# EAGLE schematic NanoRemotev2 (EAGLE 6.1)
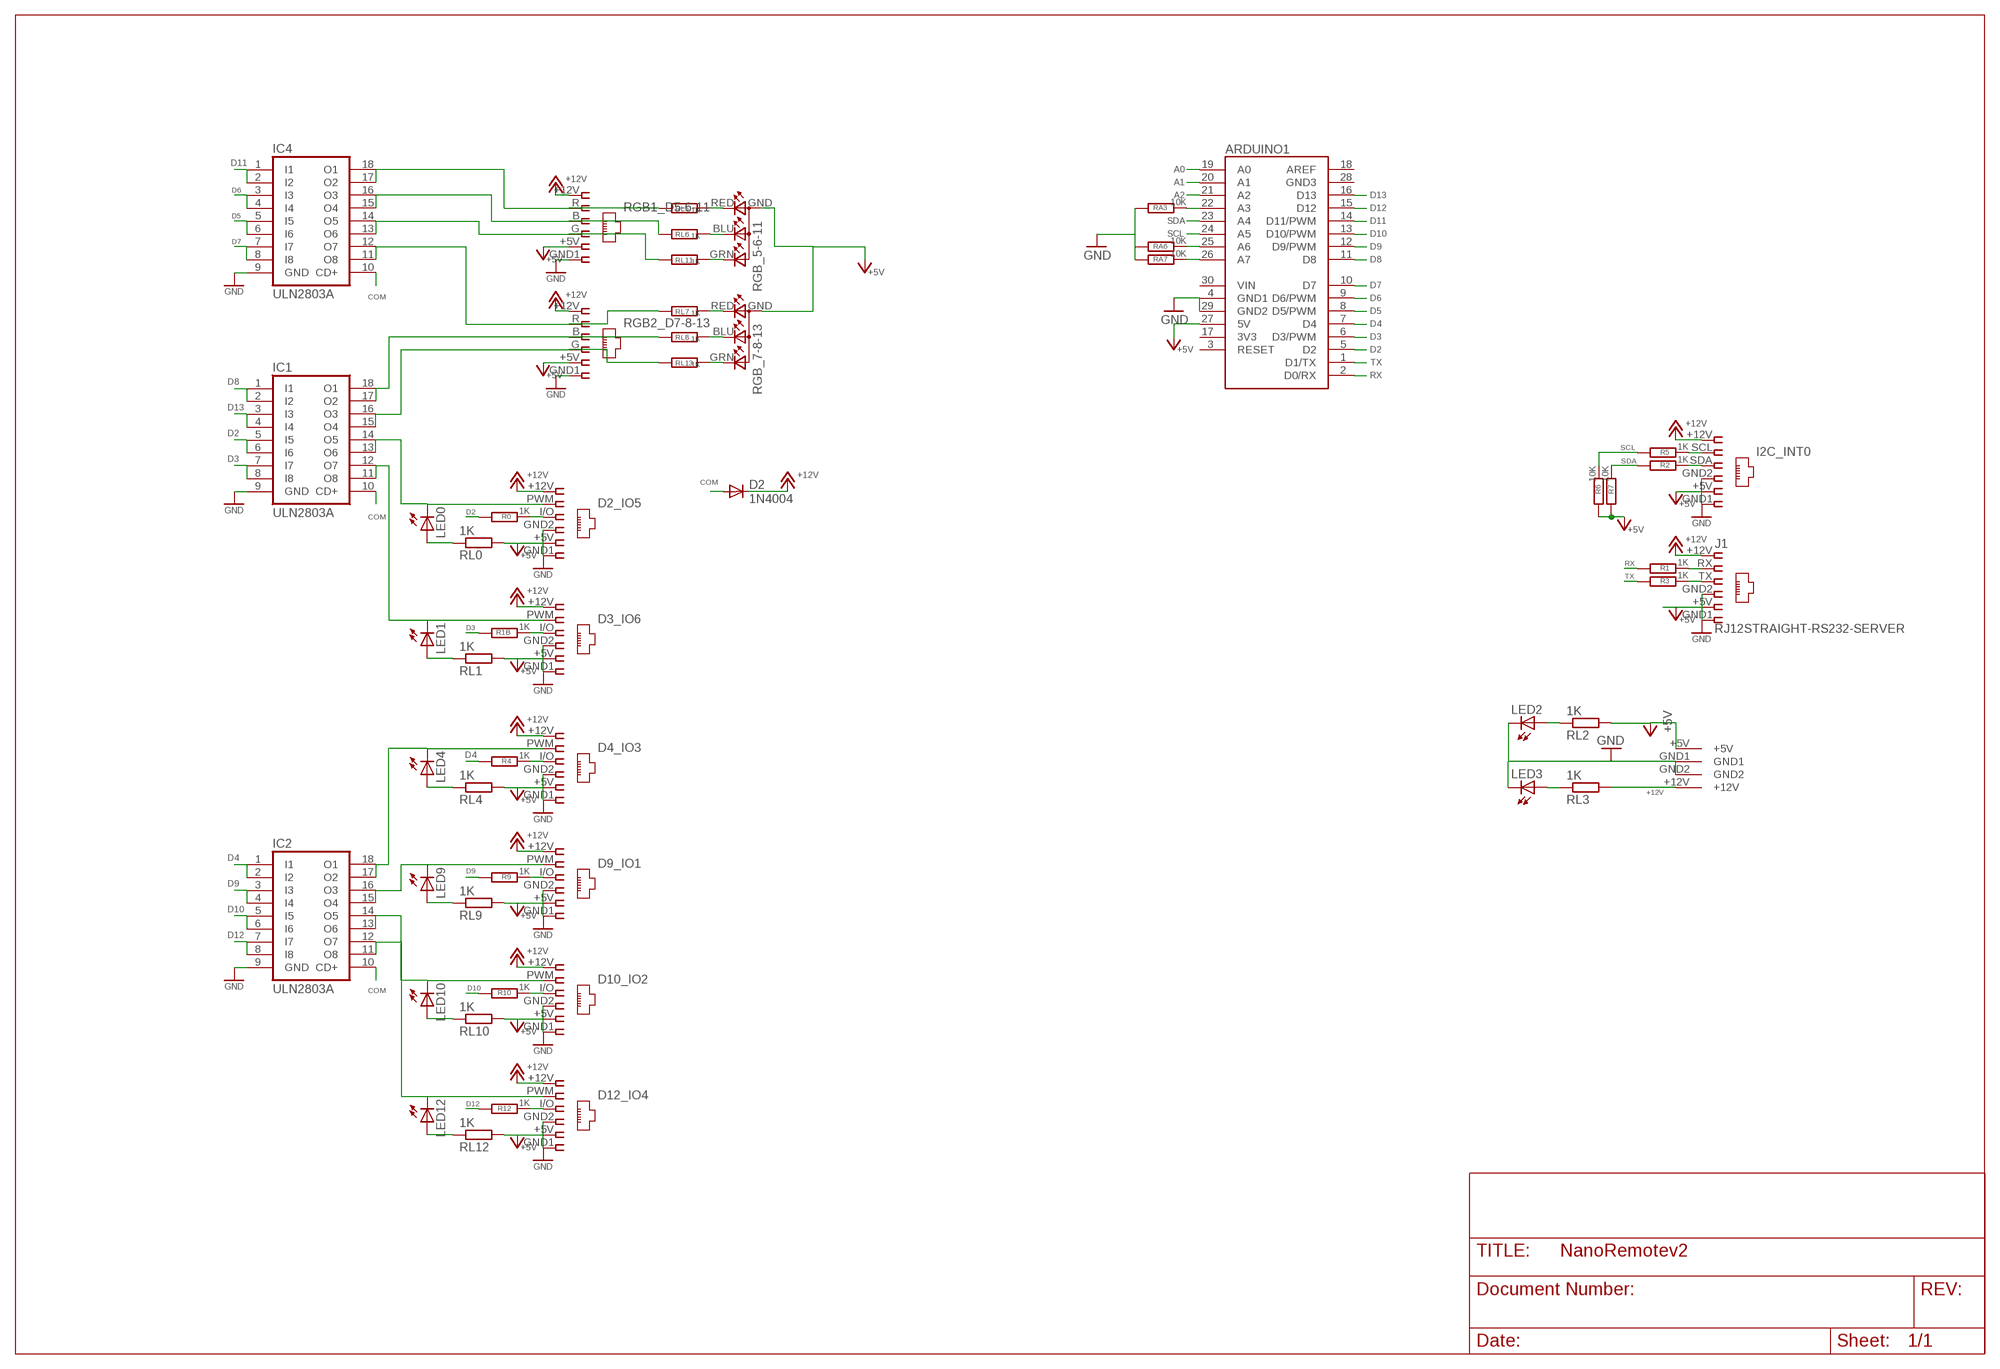
[diagram p0: schematic, sheet 1]

## Parts
ARDUINO1  ARDUINO_NANO  [ARDUINO_NANO]
D2  1N4004  [DO41-10]
D2_IO5  IO5  RJ12STRAIGHT  [RJ12-STRAIGHT]
D3_IO6  IO6  RJ12STRAIGHT  [RJ12-STRAIGHT]
D4_IO3  IO3  RJ12STRAIGHT  [RJ12-STRAIGHT]
D9_IO1  IO1  RJ12STRAIGHT  [RJ12-STRAIGHT]
D10_IO2  IO2  RJ12STRAIGHT  [RJ12-STRAIGHT]
D12_IO4  IO4  RJ12STRAIGHT  [RJ12-STRAIGHT]
I2C_INT0  I2C  RJ12STRAIGHT-I2C  [RJ12-STRAIGHT-I2C]
IC1  ULN2803A  [SO18W]
IC2  ULN2803A  [SO18W]
IC4  ULN2803A  [SO18W]
J1  RJ12STRAIGHT-RS232-SERVER  [RJ12-STRAIGHT-RS232]
LED0  LED3MM  [LED3MM]
LED1  LED3MM  [LED3MM]
LED2  LED3MM  [LED3MM]
LED3  LED3MM  [LED3MM]
LED4  LED3MM  [LED3MM]
LED9  LED3MM  [LED3MM]
LED10  LED3MM  [LED3MM]
LED12  LED3MM  [LED3MM]
R0  1K  R-EU_M1206  [M1206]
R1  1K  R-EU_M1206  [M1206]
R1B  1K  R-EU_M1206  [M1206]
R2  1K  R-EU_M1206  [M1206]
R3  1K  R-EU_M1206  [M1206]
R4  1K  R-EU_M1206  [M1206]
R5  1K  R-EU_M1206  [M1206]
R6  10K  R-EU_M1206  [M1206]
R7  10K  R-EU_M1206  [M1206]
R9  1K  R-EU_M1206  [M1206]
R10  1K  R-EU_M1206  [M1206]
R12  1K  R-EU_M1206  [M1206]
RA3  10K  R-EU_M1206  [M1206]
RA6  10K  R-EU_M1206  [M1206]
RA7  10K  R-EU_M1206  [M1206]
RGB1_D5-6-11  RGB1  RJ12STRAIGHT-RGB  [RJ12-STRAIGHT-RGB]
RGB2_D7-8-13  RGB2  RJ12STRAIGHT-RGB  [RJ12-STRAIGHT-RGB]
RGB_5-6-11  TOPLED-3  [LED-TRICOLOR-THROUGHHOLE]
RGB_7-8-13  TOPLED-3  [LED-TRICOLOR-THROUGHHOLE]
RL0  1K  R-EU_M1206  [M1206]
RL1  1K  R-EU_M1206  [M1206]
RL2  1K  R-EU_M1206  [M1206]
RL3  1K  R-EU_M1206  [M1206]
RL4  1K  R-EU_M1206  [M1206]
RL5  1K  R-EU_M1206  [M1206]
RL6  1K  R-EU_M1206  [M1206]
RL7  1K  R-EU_M1206  [M1206]
RL8  1K  R-EU_M1206  [M1206]
RL9  1K  R-EU_M1206  [M1206]
RL10  1K  R-EU_M1206  [M1206]
RL11  1K  R-EU_M1206  [M1206]
RL12  1K  R-EU_M1206  [M1206]
RL13  1K  R-EU_M1206  [M1206]
U$1  KPJX-4S-S  [KPJX-4S-S]

## Nets
+5V [highpower]: ARDUINO1.27(5V) D2_IO5.+5V D3_IO6.+5V D4_IO3.+5V D9_IO1.+5V D10_IO2.+5V D12_IO4.+5V I2C_INT0.+5V J1.+5V R6.2 R7.2 RGB1_D5-6-11.+5V RGB2_D7-8-13.+5V RGB_5-6-11.GND(A2) RGB_7-8-13.GND(A2) RL0.2 RL1.2 RL2.2 RL4.2 RL9.2 RL10.2 RL12.2 U$1.+5V
+12V [highpower]: D2.C D2_IO5.+12V D3_IO6.+12V D4_IO3.+12V D9_IO1.+12V D10_IO2.+12V D12_IO4.+12V I2C_INT0.+12V J1.+12V RGB1_D5-6-11.+12V RGB2_D7-8-13.+12V RL3.2 U$1.+12V
A0: ARDUINO1.19(A0)
A1: ARDUINO1.20(A1)
A2: ARDUINO1.21(A2)
COM: D2.A IC1.10(CD+) IC2.10(CD+) IC4.10(CD+)
D2: ARDUINO1.5(D2) IC1.5(I5) IC1.6(I6) R0.2
D2B: D4_IO3.I/O R4.1
D2B1: D9_IO1.I/O R9.1
D2B2: D10_IO2.I/O R10.1
D2B3: D12_IO4.I/O R12.1
D2B4: I2C_INT0.SDA R2.1
D2B5: J1.TX R3.1
D2B6: D2_IO5.I/O R0.1
D2B7: D3_IO6.I/O R1B.1
D3: ARDUINO1.6(D3/PWM) IC1.7(I7) IC1.8(I8) R1B.2
D4: ARDUINO1.7(D4) IC2.1(I1) IC2.2(I2) R4.2
D5: ARDUINO1.8(D5/PWM) IC4.5(I5) IC4.6(I6)
D6: ARDUINO1.9(D6/PWM) IC4.3(I3) IC4.4(I4)
D7: ARDUINO1.10(D7) IC4.7(I7) IC4.8(I8)
D8: ARDUINO1.11(D8) IC1.1(I1) IC1.2(I2)
D9: ARDUINO1.12(D9/PWM) IC2.3(I3) IC2.4(I4) R9.2
D10: ARDUINO1.13(D10/PWM) IC2.5(I5) IC2.6(I6) R10.2
D11: ARDUINO1.14(D11/PWM) IC4.1(I1) IC4.2(I2)
D12: ARDUINO1.15(D12) IC2.7(I7) IC2.8(I8) R12.2
D13: ARDUINO1.16(D13) IC1.3(I3) IC1.4(I4)
GND [highpower]: ARDUINO1.4(GND1) ARDUINO1.29(GND2) D2_IO5.GND1 D2_IO5.GND2 D3_IO6.GND1 D3_IO6.GND2 D4_IO3.GND1 D4_IO3.GND2 D9_IO1.GND1 D9_IO1.GND2 D10_IO2.GND1 D10_IO2.GND2 D12_IO4.GND1 D12_IO4.GND2 I2C_INT0.GND1 I2C_INT0.GND2 IC1.9(GND) IC2.9(GND) IC4.9(GND) J1.GND1 J1.GND2 LED2.K(C) LED3.K(C) RA3.2 RA6.2 RA7.2 RGB1_D5-6-11.GND1 RGB2_D7-8-13.GND1 U$1.GND1 U$1.GND2
N$1: RGB_5-6-11.RED(CRED) RL5.2
N$2: RGB_5-6-11.BLU(CBLUE) RL6.2
N$3 [power]: IC1.17(O2) IC1.18(O1) RGB2_D7-8-13.B RL8.1
N$4: RGB_5-6-11.GRN(CGREEN) RL11.2
N$5 [power]: IC4.17(O2) IC4.18(O1) RGB1_D5-6-11.R RL5.1
N$6 [power]: IC4.15(O4) IC4.16(O3) RGB1_D5-6-11.B RL6.1
N$7: J1.RX R1.1
N$8: I2C_INT0.SCL R5.1
N$9: RGB_7-8-13.RED(CRED) RL7.2
N$11: RGB_7-8-13.BLU(CBLUE) RL8.2
N$12: LED9.A RL9.1
N$13: LED3.A RL3.1
N$14: RGB_7-8-13.GRN(CGREEN) RL13.2
N$15: LED4.A RL4.1
N$16: ARDUINO1.22(A3) RA3.1
N$17 [power]: IC4.13(O6) IC4.14(O5) RGB1_D5-6-11.G RL11.1
N$18 [power]: D4_IO3.PWM IC2.17(O2) IC2.18(O1) LED4.K(C)
N$19 [power]: IC4.11(O8) IC4.12(O7) RGB2_D7-8-13.R RL7.1
N$20: ARDUINO1.25(A6) RA6.1
N$21: LED10.A RL10.1
N$22: ARDUINO1.26(A7) RA7.1
N$23: LED2.A RL2.1
N$24 [power]: D10_IO2.PWM IC2.13(O6) IC2.14(O5) LED10.K(C)
N$28: LED12.A RL12.1
N$29 [power]: IC1.15(O4) IC1.16(O3) RGB2_D7-8-13.G RL13.1
N$35 [power]: D3_IO6.PWM IC1.11(O8) IC1.12(O7) LED1.K(C)
N$38: LED0.A RL0.1
N$40 [power]: D2_IO5.PWM IC1.13(O6) IC1.14(O5) LED0.K(C)
N$41: LED1.A RL1.1
N$42 [power]: D9_IO1.PWM IC2.15(O4) IC2.16(O3) LED9.K(C)
N$44 [power]: D12_IO4.PWM IC2.11(O8) IC2.12(O7) LED12.K(C)
RX: ARDUINO1.2(D0/RX) R1.2
SCL: ARDUINO1.24(A5) R5.2 R6.1
SDA: ARDUINO1.23(A4) R2.2 R7.1
TX: ARDUINO1.1(D1/TX) R3.2
Unconnected: ARDUINO1.3(RESET) ARDUINO1.18(AREF) ARDUINO1.28(GND3) ARDUINO1.30(VIN)

## Power pins joined to a net without a drawn wire
3V3: ARDUINO1.17(3V3)

## Library data of the parts
ARDUINO1 = arduino:ARDUINO_NANO: Arduino Nano I/O pin arrangement
D2 = diode:1N4004: DIODE general purpose rectifier, 1 A
D2_IO5 D3_IO6 D4_IO3 D9_IO1 D10_IO2 D12_IO4 I2C_INT0 J1 RGB1_D5-6-11 RGB2_D7-8-13 = lpatiny:RJ12: CORCOM Modular RJ Jacks No Shield Source: www.tycoelectronics.com .. ENG_DS_1654001_1099_RJ_L_0507.pdf
IC1 IC2 IC4 = lpatiny:ULN2803A: DRIVER ARRAY
LED0 LED1-LED4 LED9 LED10 LED12 = lpatiny:LED3MM
R0 R1 R1B R2-R7 R9 R10 R12 RA3 RA6 RA7 RL0 RL1-RL13 = resistor:R-EU_: RESISTOR, European symbol
RGB_5-6-11 RGB_7-8-13 = lpatiny:TOPLED-3: OSRAM - Hyper Multi TOPLED® (RGB) LB E673, LV E673, LT E673 - Power TOPLED® Enhanced optical Power LED (HOP2000) LS E67B, LA E67B, LO E67B, LY E67B - Hyper Multi TOPLED® Enhanced optical Power LED (HOP2000 / ATON®) LATB T66B - Hyper Multi TOPLED® Hyper-Bright LED LATB T686 Source: http://www.osram.convergy.de/
U$1 = lpatiny:KPJX-4S-S

## Net classes
0 default: width 0.457 mm
1 power: width 0.914 mm
2 highpower: width 1.372 mm